# Altium schematic sheet 接线图.SchDoc
size A3; PageSetup: Record=PageOptions|CenterHorizontal=True|CenterVertical=True|PrintScale=1.04|XCorrection=1.00|YCorrection=1.00|PrintKind=0|BorderSize=5000000|LeftOffset=0|BottomOffset=0|Orientation=2|PaperLength=1000|PaperWidth=1000|Scale=100|PaperSource=7|PrintQuality=600|MediaType=1|DitherType=10|PaperKind=A3|PrintScaleMode=1
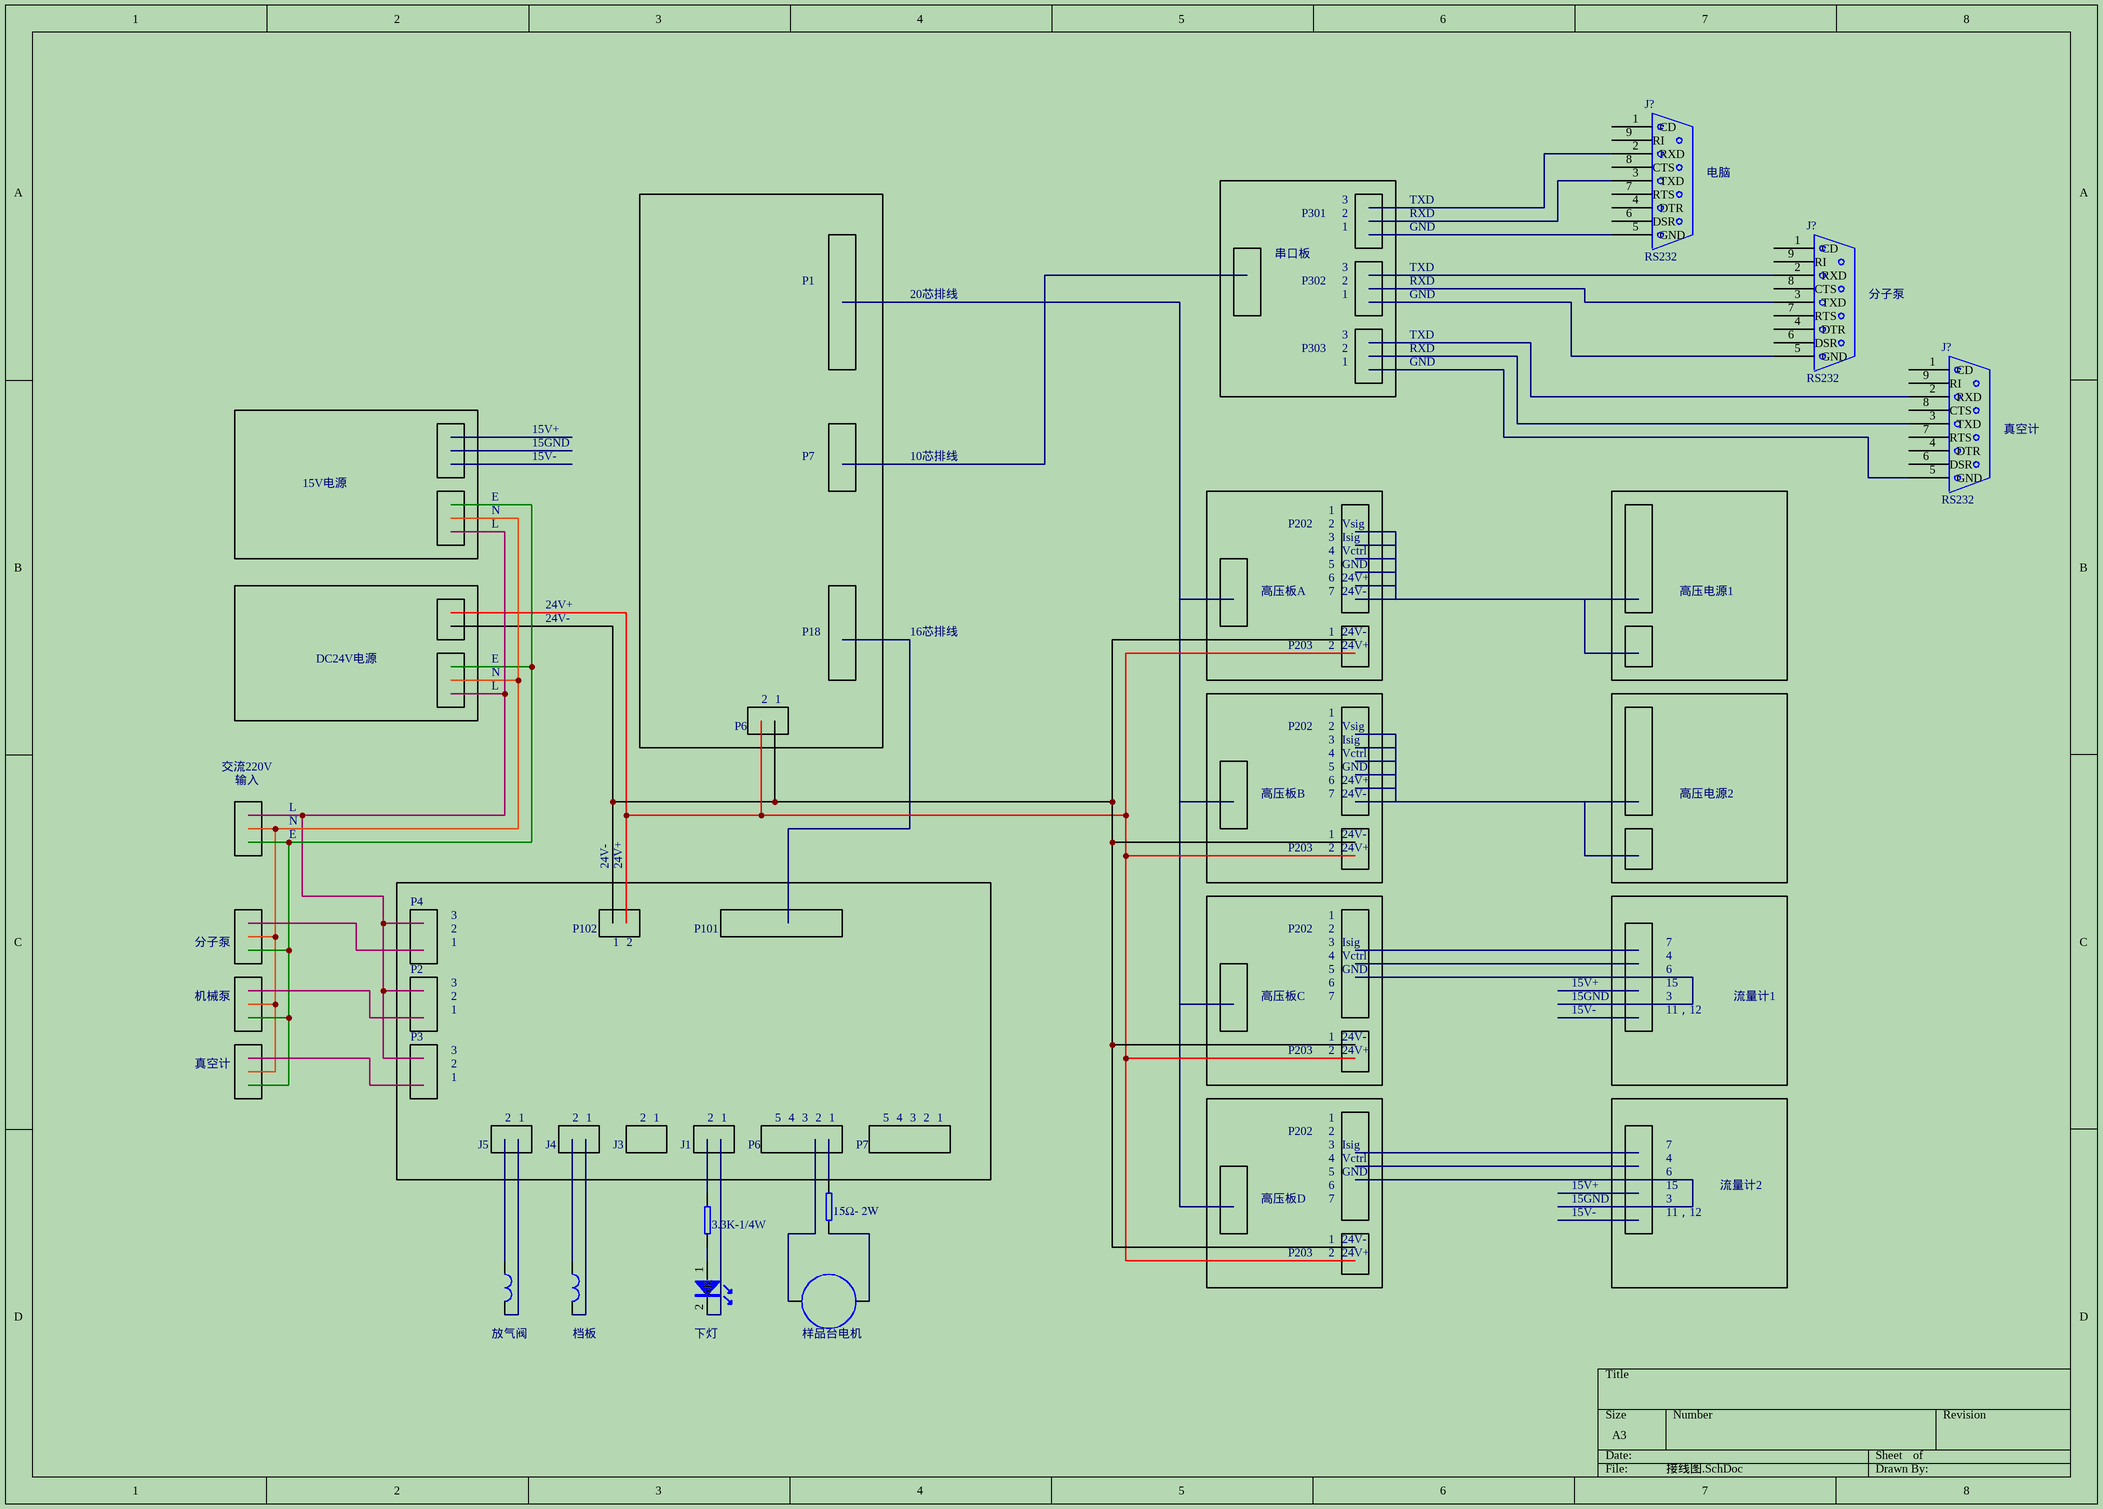
[diagram p0: 接线图.SchDoc]

## Parts
(Parts that share a designator on the sheet are numbered #1, #2 ... from top to bottom, then left to right.)
?  样品台电机
D?  下灯  [LED3]
J?#1  RS232  [DB9P/M]
J?#2  RS232  [DB9P/M]
J?#3  RS232  [DB9P/M]
L?#1  放气阀
L?#2  档板
R?#1  15Ω-2W  [R0603]
R?#2  3.3K-1/4W  [R0603]

## Nets
Net?_2: ?.2 R?#1.1
NetD?_1: D?.1(A) R?#2.1

Not connected (* = marked no-connect by the designer): ? 1; D? 2(K); J?#1 1(CD) 2(RXD) 3(TXD) 4(DTR) 5(GND) 6(DSR) 7(RTS) 8(CTS) 9(RI); J?#2 1(CD) 2(RXD) 3(TXD) 4(DTR) 5(GND) 6(DSR) 7(RTS) 8(CTS) 9(RI); J?#3 1(CD) 2(RXD) 3(TXD) 4(DTR) 5(GND) 6(DSR) 7(RTS) 8(CTS) 9(RI); L?#1 1 2; L?#2 1 2; R?#1 2; R?#2 2

## Notes on the sheet
- 电脑
- P301
- 1
- 2
- 3
- TXD
- RXD
- GND
- P1
- 20芯排线
- 串口板
- P302
- 分子泵
- P303
- 15V+
- 15GND
- 真空计
- 15V电源
- N
- E
- 15V-
- P7
- 10芯排线
- L
- P202
- 4
- 5
- 6
- Vsig
- Isig
- Vctrl
- 24V+
- 24V-
- P18
- 16芯排线
- 高压板A
- P203
- 7
- 高压电源1
- DC24V电源
- 交流220V
- 输入
- P6
- 高压板B
- 高压电源2
- P4
- P2
- P102
- P101
- 15
- 机械泵
- P3
- 高压板C
- 11，12
- 流量计1
- J5
- J4
- J3
- J1
- (near R?#1) P7
- 流量计2
- 高压板D

## Library data of the parts
? = METER
D? = LED
J?#1-J?#3 = RS232: Direction is DTE (Computer) relative DCE (Modem). (At the Computer)
L?#1 L?#2 = L1
R?#1 R?#2 = R: Resistor; Text Field1: 0402-1/16W-50V; Text Field2: 0603-1/16W-50V; Text Field3: 0805-1/10W-150V; Text Field4: 1206-1/8W-200V; Text Field5: 1210-1/4W-200V; Text Field6: 2010-1/2W-200V--2512-1W-200V; Text Field7: For G 2 %,J 5 % ( E - 24 ) 10 11 12 13 15 16 18 20 22 24 27 30 33 36 39 43 47 51 56 62 68 75 82 91; Text Field8: For F 1 % ( E - 96 ) 100 102 105 107 110 113 115 118 121 124 127 130 133 137 140 143 147 150 154 158 162 165 169 174 178 182 187 191 196 200 205 210 215 221 226 232 237 243 249 255 261 267 174 280 287 294 301 309 316 324 332 340 348 357 365 374 383 392 40